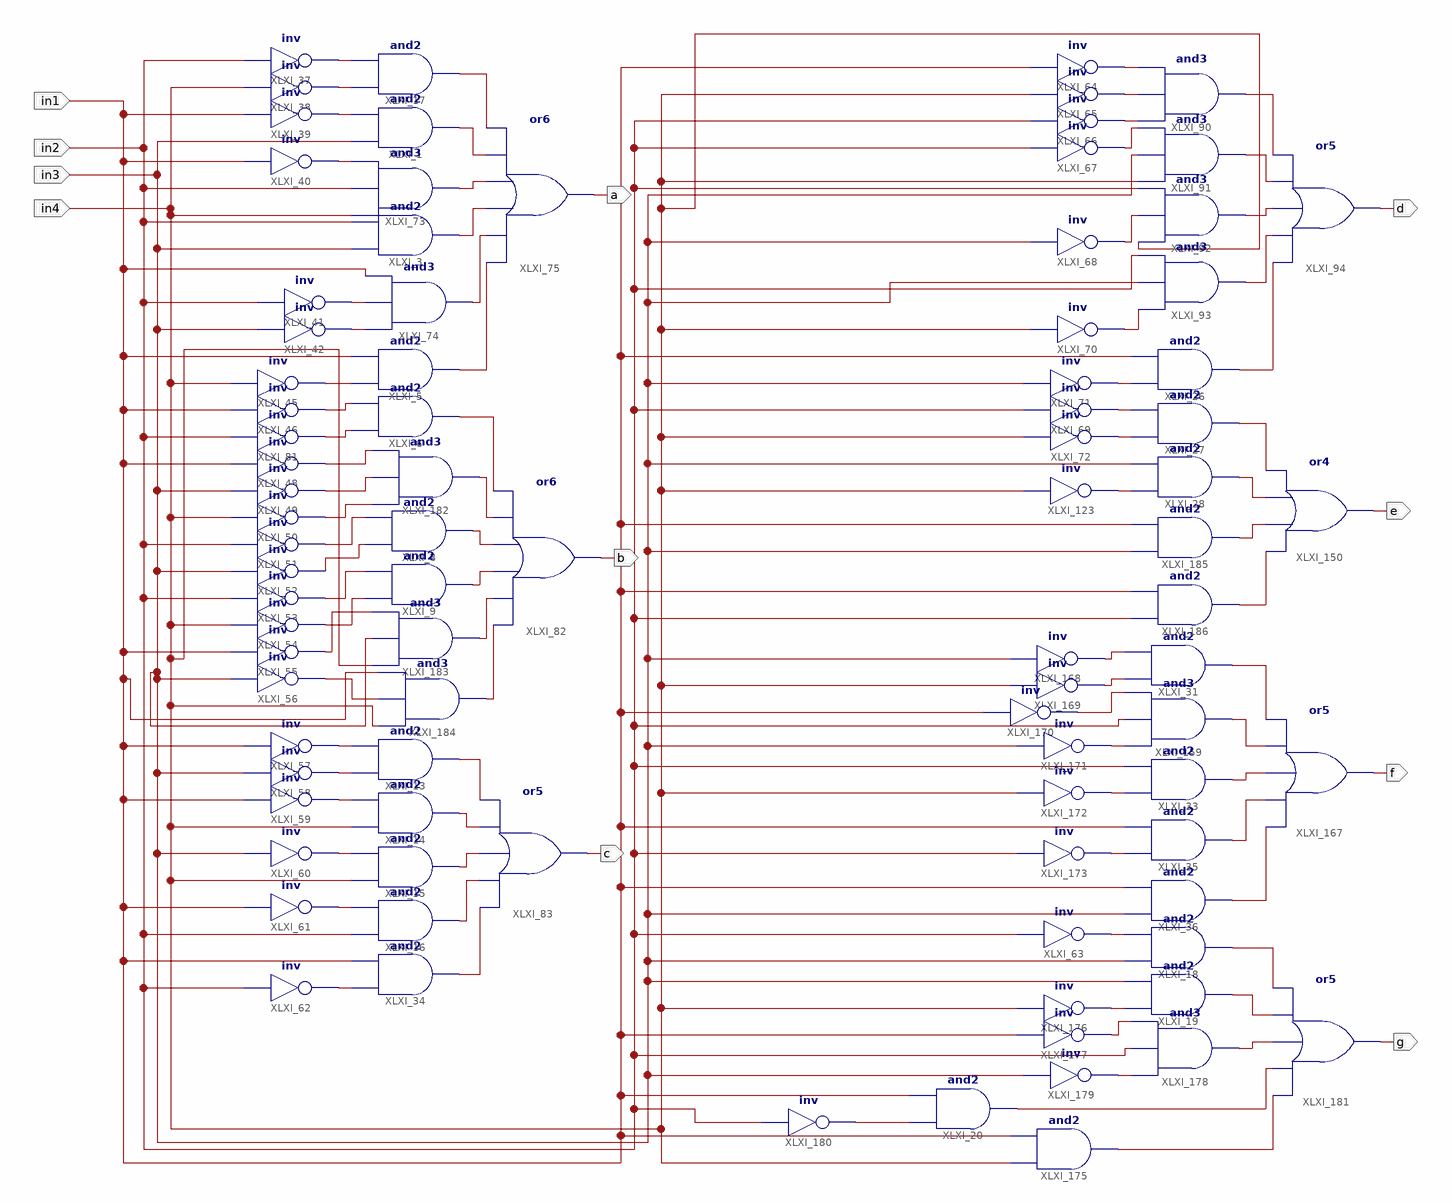
[diagram p0: schematic sheet 1]
// Xilinx ISE schematic Decoderto7segment.sch (spartan6) as structural Verilog: 88 symbols, 11 ports
module Decoderto7segment (
  input  in1,
  input  in2,
  input  in3,
  input  in4,
  output a,
  output b,
  output c,
  output g,
  output f,
  output e,
  output d
);

  wire XLXN_12, XLXN_13, XLXN_15, XLXN_16, XLXN_18, XLXN_19, XLXN_20, XLXN_25, XLXN_26, XLXN_29, XLXN_31,
       XLXN_33, XLXN_36, XLXN_37, XLXN_38, XLXN_39, XLXN_40, XLXN_41, XLXN_42, XLXN_43, XLXN_44, XLXN_45,
       XLXN_47, XLXN_48, XLXN_49, XLXN_52, XLXN_53, XLXN_54, XLXN_57, XLXN_58, XLXN_59, XLXN_60, XLXN_61,
       XLXN_62, XLXN_63, XLXN_64, XLXN_65, XLXN_66, XLXN_67, XLXN_68, XLXN_69, XLXN_70, XLXN_71, XLXN_72,
       XLXN_73, XLXN_74, XLXN_75, XLXN_78, XLXN_79, XLXN_80, XLXN_81, XLXN_82, XLXN_83, XLXN_102, XLXN_103,
       XLXN_104, XLXN_119, XLXN_120, XLXN_121, XLXN_122, XLXN_124, XLXN_125, XLXN_126, XLXN_127, XLXN_128,
       XLXN_129, XLXN_131, XLXN_132, XLXN_133, XLXN_134, XLXN_135, XLXN_136, XLXN_137, XLXN_138, XLXN_139,
       XLXN_140, XLXN_145, XLXN_146, XLXN_147, XLXN_148, XLXN_149;

  and XLXI_1 (XLXN_43, in3, XLXN_15);
  and XLXI_3 (XLXN_45, in3, in2);
  and XLXI_5 (XLXN_48, XLXN_20, in1);
  and XLXI_6 (XLXN_49, XLXN_26, XLXN_25);
  and XLXI_8 (XLXN_53, XLXN_37, XLXN_36);
  and XLXI_9 (XLXN_54, XLXN_39, XLXN_38);
  and XLXI_13 (XLXN_59, XLXN_65, XLXN_64);
  and XLXI_14 (XLXN_60, in4, XLXN_66);
  and XLXI_15 (XLXN_61, in4, XLXN_67);
  and XLXI_16 (XLXN_62, in2, XLXN_68);
  and XLXI_17 (XLXN_42, XLXN_12, XLXN_13);
  and XLXI_20 (XLXN_148, XLXN_140, in1);
  and XLXI_34 (XLXN_63, XLXN_69, in1);
  not XLXI_37 (XLXN_13, in2);
  not XLXI_38 (XLXN_12, in4);
  not XLXI_39 (XLXN_15, in1);
  not XLXI_40 (XLXN_16, in1);
  not XLXI_41 (XLXN_19, in2);
  not XLXI_42 (XLXN_18, in3);
  not XLXI_45 (XLXN_20, in4);
  not XLXI_46 (XLXN_25, in1);
  not XLXI_48 (XLXN_29, in1);
  not XLXI_49 (XLXN_31, in3);
  not XLXI_50 (XLXN_33, in4);
  not XLXI_51 (XLXN_36, in2);
  not XLXI_52 (XLXN_37, in3);
  not XLXI_53 (XLXN_38, in2);
  not XLXI_54 (XLXN_39, in4);
  not XLXI_55 (XLXN_40, in1);
  not XLXI_56 (XLXN_41, in3);
  not XLXI_57 (XLXN_64, in1);
  not XLXI_58 (XLXN_65, in3);
  not XLXI_59 (XLXN_66, in1);
  not XLXI_60 (XLXN_67, in3);
  not XLXI_61 (XLXN_68, in1);
  not XLXI_62 (XLXN_69, in2);
  and XLXI_73 (XLXN_44, in4, in2, XLXN_16);
  and XLXI_74 (XLXN_47, XLXN_18, XLXN_19, in1);
  or XLXI_75 (a, XLXN_48, XLXN_47, XLXN_45, XLXN_44, XLXN_43, XLXN_42);
  not XLXI_81 (XLXN_26, in2);
  or XLXI_82 (b, XLXN_58, XLXN_57, XLXN_54, XLXN_53, XLXN_52, XLXN_49);
  or XLXI_83 (c, XLXN_63, XLXN_62, XLXN_61, XLXN_60, XLXN_59);
  and XLXI_27 (XLXN_119, XLXN_103, XLXN_102);
  and XLXI_18 (XLXN_145, in3, XLXN_136);
  and XLXI_19 (XLXN_146, XLXN_137, in3);
  not XLXI_63 (XLXN_136, in2);
  and XLXI_93 (XLXN_82, XLXN_75, in3, in2);
  and XLXI_90 (XLXN_79, XLXN_72, XLXN_71, XLXN_70);
  not XLXI_64 (XLXN_70, in1);
  not XLXI_65 (XLXN_71, in4);
  not XLXI_66 (XLXN_72, in2);
  and XLXI_91 (XLXN_80, in4, in3, XLXN_73);
  and XLXI_92 (XLXN_81, in4, XLXN_74, in2);
  not XLXI_67 (XLXN_73, in2);
  not XLXI_68 (XLXN_74, in3);
  not XLXI_69 (XLXN_102, in2);
  not XLXI_70 (XLXN_75, in4);
  not XLXI_72 (XLXN_103, in4);
  or XLXI_94 (d, XLXN_83, XLXN_82, XLXN_81, XLXN_80, XLXN_79);
  and XLXI_26 (XLXN_83, XLXN_78, in1);
  not XLXI_71 (XLXN_78, in3);
  not XLXI_123 (XLXN_104, in4);
  and XLXI_28 (XLXN_120, XLXN_104, in3);
  or XLXI_150 (e, XLXN_122, XLXN_121, XLXN_120, XLXN_119);
  and XLXI_31 (XLXN_124, XLXN_131, XLXN_129);
  and XLXI_159 (XLXN_125, XLXN_132, in2, XLXN_133);
  and XLXI_33 (XLXN_126, XLXN_134, in2);
  and XLXI_35 (XLXN_127, XLXN_135, in1);
  and XLXI_36 (XLXN_128, in3, in1);
  or XLXI_167 (f, XLXN_128, XLXN_127, XLXN_126, XLXN_125, XLXN_124);
  not XLXI_168 (XLXN_129, in3);
  not XLXI_169 (XLXN_131, in4);
  not XLXI_170 (XLXN_133, in1);
  not XLXI_171 (XLXN_132, in3);
  not XLXI_172 (XLXN_134, in4);
  not XLXI_173 (XLXN_135, in2);
  and XLXI_175 (XLXN_149, in4, in1);
  not XLXI_176 (XLXN_137, in4);
  not XLXI_177 (XLXN_138, in1);
  and XLXI_178 (XLXN_147, XLXN_139, in2, XLXN_138);
  not XLXI_179 (XLXN_139, in3);
  not XLXI_180 (XLXN_140, in2);
  or XLXI_181 (g, XLXN_149, XLXN_148, XLXN_147, XLXN_146, XLXN_145);
  and XLXI_182 (XLXN_52, XLXN_33, XLXN_31, XLXN_29);
  and XLXI_183 (XLXN_57, in4, in3, XLXN_40);
  and XLXI_184 (XLXN_58, in4, XLXN_41, in1);
  and XLXI_185 (XLXN_121, in3, in1);
  and XLXI_186 (XLXN_122, in2, in1);
endmodule
